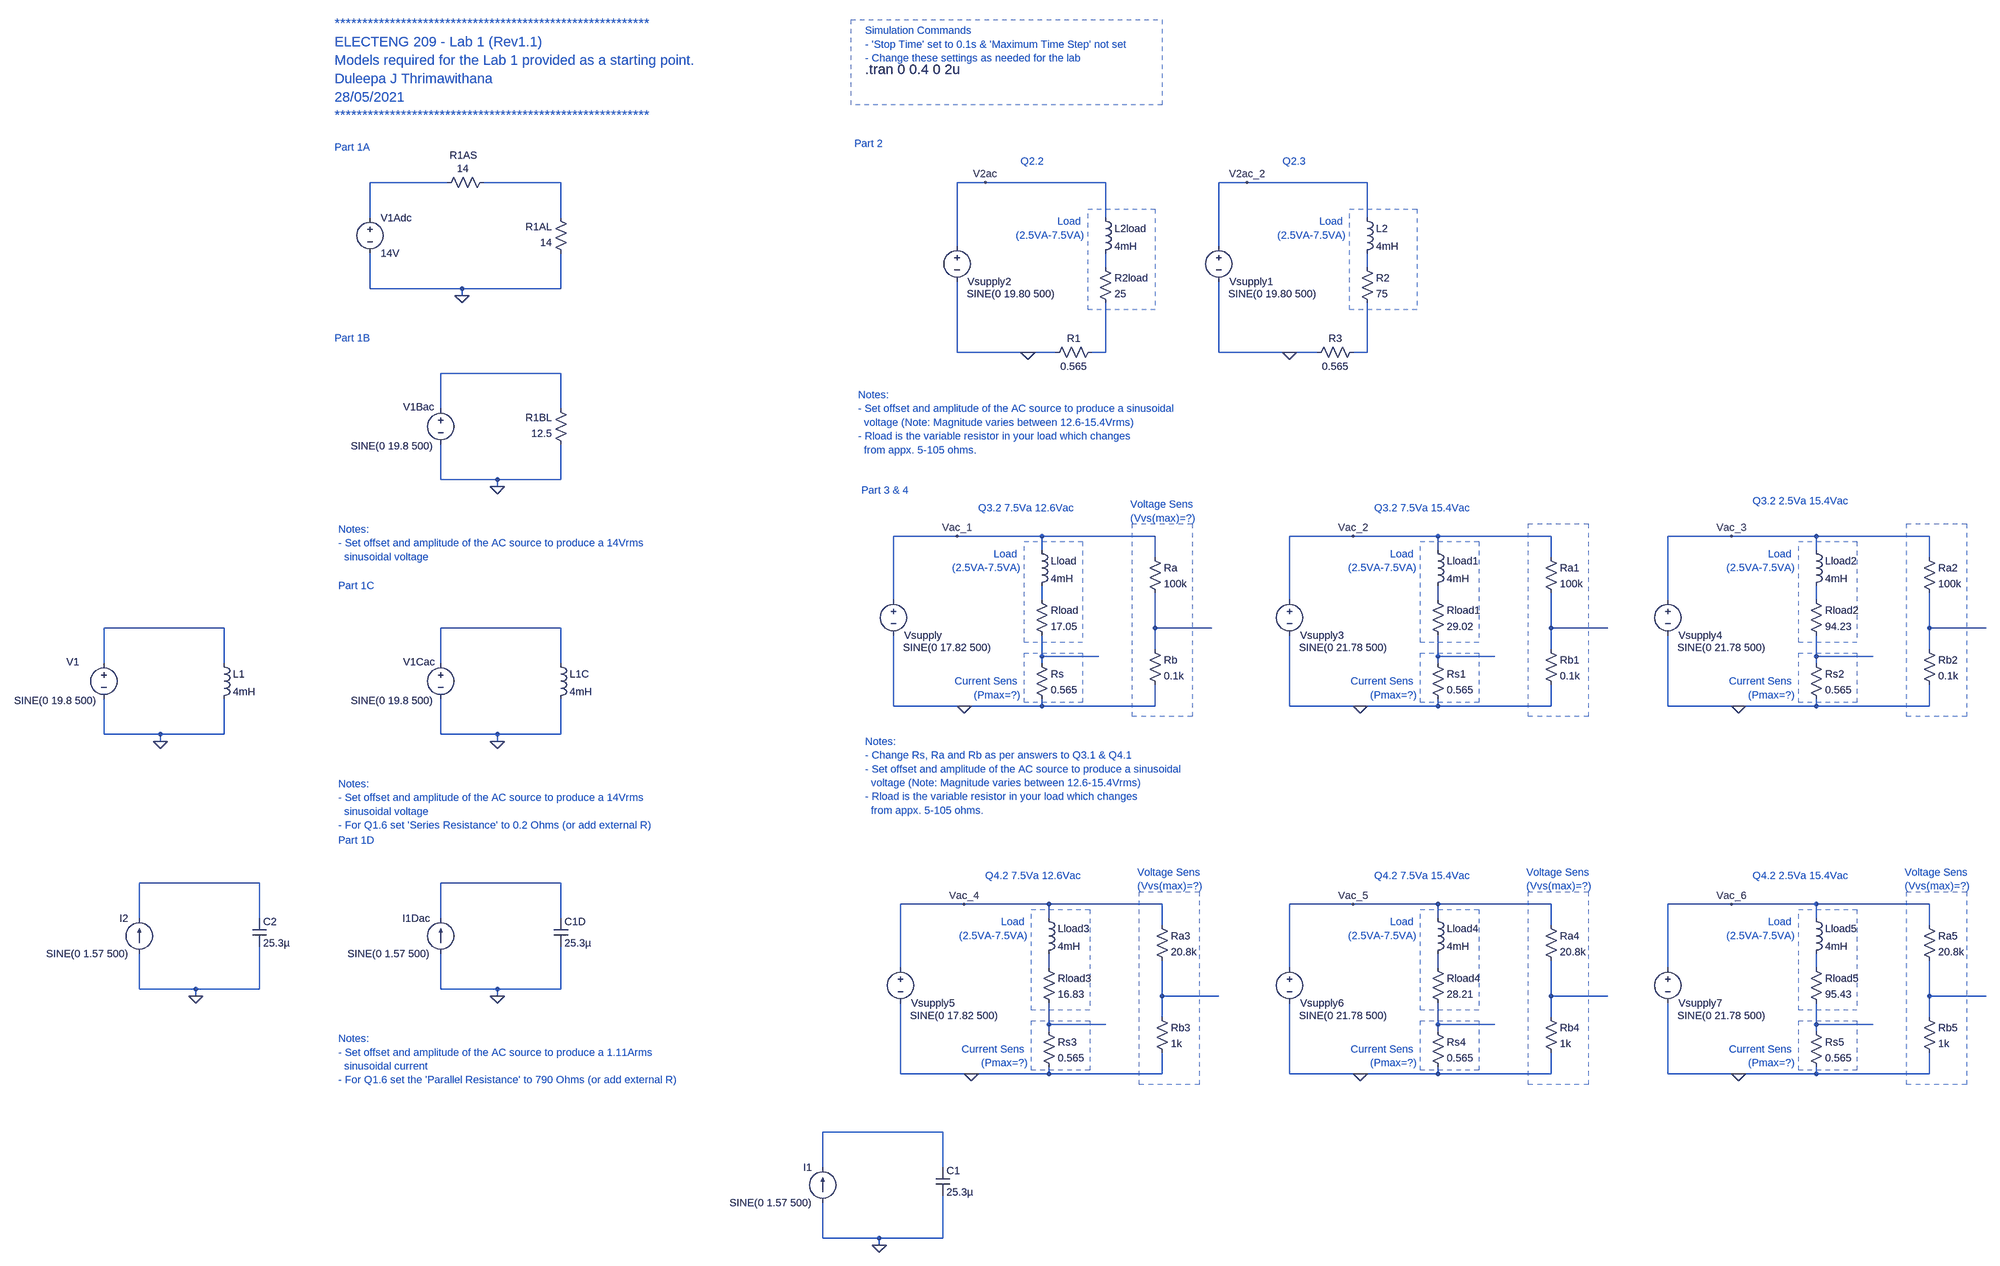
[diagram p0: schematic Lab1_Sensors_Q4.asc]
Lab1_Sensors_Q4.asc, the LTspice schematic file:
Version 4.1
SHEET 1 2980 2980
WIRE -528 144 -704 144
WIRE -272 144 -448 144
WIRE 688 144 624 144
WIRE 960 144 688 144
WIRE 1280 144 1216 144
WIRE 1552 144 1280 144
WIRE -704 224 -704 144
WIRE -272 224 -272 144
WIRE 960 224 960 144
WIRE 1552 224 1552 144
WIRE 624 288 624 144
WIRE 1216 288 1216 144
WIRE 960 336 960 304
WIRE 1552 336 1552 304
WIRE -704 384 -704 304
WIRE -496 384 -704 384
WIRE -272 384 -272 304
WIRE -272 384 -496 384
WIRE -496 400 -496 384
WIRE 624 528 624 368
WIRE 784 528 624 528
WIRE 848 528 784 528
WIRE 960 528 960 416
WIRE 960 528 928 528
WIRE 1216 528 1216 368
WIRE 1376 528 1216 528
WIRE 1440 528 1376 528
WIRE 1552 528 1552 416
WIRE 1552 528 1520 528
WIRE -272 576 -544 576
WIRE -544 656 -544 576
WIRE -272 656 -272 576
WIRE -544 816 -544 736
WIRE -416 816 -544 816
WIRE -272 816 -272 736
WIRE -272 816 -416 816
WIRE -416 832 -416 816
WIRE 624 944 480 944
WIRE 816 944 624 944
WIRE 1072 944 816 944
WIRE 1520 944 1376 944
WIRE 1712 944 1520 944
WIRE 1968 944 1712 944
WIRE 2384 944 2240 944
WIRE 2576 944 2384 944
WIRE 2832 944 2576 944
WIRE 816 976 816 944
WIRE 1712 976 1712 944
WIRE 2576 976 2576 944
WIRE 1072 992 1072 944
WIRE 1968 992 1968 944
WIRE 2832 992 2832 944
WIRE 480 1088 480 944
WIRE 816 1088 816 1056
WIRE 1376 1088 1376 944
WIRE 1712 1088 1712 1056
WIRE 2240 1088 2240 944
WIRE 2576 1088 2576 1056
WIRE -1184 1152 -1456 1152
WIRE -272 1152 -544 1152
WIRE 1072 1152 1072 1072
WIRE 1200 1152 1072 1152
WIRE 1968 1152 1968 1072
WIRE 2096 1152 1968 1152
WIRE 2832 1152 2832 1072
WIRE 2960 1152 2832 1152
WIRE 1072 1200 1072 1152
WIRE 1968 1200 1968 1152
WIRE 2832 1200 2832 1152
WIRE 816 1216 816 1168
WIRE 944 1216 816 1216
WIRE 1712 1216 1712 1168
WIRE 1840 1216 1712 1216
WIRE 2576 1216 2576 1168
WIRE 2704 1216 2576 1216
WIRE -1456 1232 -1456 1152
WIRE -1184 1232 -1184 1152
WIRE -544 1232 -544 1152
WIRE -272 1232 -272 1152
WIRE 816 1232 816 1216
WIRE 1712 1232 1712 1216
WIRE 2576 1232 2576 1216
WIRE 480 1328 480 1168
WIRE 640 1328 480 1328
WIRE 816 1328 816 1312
WIRE 816 1328 640 1328
WIRE 1072 1328 1072 1280
WIRE 1072 1328 816 1328
WIRE 1376 1328 1376 1168
WIRE 1536 1328 1376 1328
WIRE 1712 1328 1712 1312
WIRE 1712 1328 1536 1328
WIRE 1968 1328 1968 1280
WIRE 1968 1328 1712 1328
WIRE 2240 1328 2240 1168
WIRE 2400 1328 2240 1328
WIRE 2576 1328 2576 1312
WIRE 2576 1328 2400 1328
WIRE 2832 1328 2832 1280
WIRE 2832 1328 2576 1328
WIRE -1456 1392 -1456 1312
WIRE -1328 1392 -1456 1392
WIRE -1184 1392 -1184 1312
WIRE -1184 1392 -1328 1392
WIRE -544 1392 -544 1312
WIRE -416 1392 -544 1392
WIRE -272 1392 -272 1312
WIRE -272 1392 -416 1392
WIRE -1328 1408 -1328 1392
WIRE -416 1408 -416 1392
WIRE -1104 1728 -1376 1728
WIRE -272 1728 -544 1728
WIRE 640 1776 496 1776
WIRE 832 1776 640 1776
WIRE 1088 1776 832 1776
WIRE 1520 1776 1376 1776
WIRE 1712 1776 1520 1776
WIRE 1968 1776 1712 1776
WIRE 2384 1776 2240 1776
WIRE 2576 1776 2384 1776
WIRE 2832 1776 2576 1776
WIRE -1376 1808 -1376 1728
WIRE -1104 1808 -1104 1728
WIRE -544 1808 -544 1728
WIRE -272 1808 -272 1728
WIRE 832 1808 832 1776
WIRE 1712 1808 1712 1776
WIRE 2576 1808 2576 1776
WIRE 1088 1824 1088 1776
WIRE 1968 1824 1968 1776
WIRE 2832 1824 2832 1776
WIRE 496 1920 496 1776
WIRE 832 1920 832 1888
WIRE 1376 1920 1376 1776
WIRE 1712 1920 1712 1888
WIRE 2240 1920 2240 1776
WIRE 2576 1920 2576 1888
WIRE -1376 1968 -1376 1888
WIRE -1248 1968 -1376 1968
WIRE -1104 1968 -1104 1872
WIRE -1104 1968 -1248 1968
WIRE -544 1968 -544 1888
WIRE -416 1968 -544 1968
WIRE -272 1968 -272 1872
WIRE -272 1968 -416 1968
WIRE -1248 1984 -1248 1968
WIRE -416 1984 -416 1968
WIRE 1088 1984 1088 1904
WIRE 1216 1984 1088 1984
WIRE 1968 1984 1968 1904
WIRE 2096 1984 1968 1984
WIRE 2832 1984 2832 1904
WIRE 2960 1984 2832 1984
WIRE 1088 2032 1088 1984
WIRE 1968 2032 1968 1984
WIRE 2832 2032 2832 1984
WIRE 832 2048 832 2000
WIRE 960 2048 832 2048
WIRE 1712 2048 1712 2000
WIRE 1840 2048 1712 2048
WIRE 2576 2048 2576 2000
WIRE 2704 2048 2576 2048
WIRE 832 2064 832 2048
WIRE 1712 2064 1712 2048
WIRE 2576 2064 2576 2048
WIRE 496 2160 496 2000
WIRE 656 2160 496 2160
WIRE 832 2160 832 2144
WIRE 832 2160 656 2160
WIRE 1088 2160 1088 2112
WIRE 1088 2160 832 2160
WIRE 1376 2160 1376 2000
WIRE 1536 2160 1376 2160
WIRE 1712 2160 1712 2144
WIRE 1712 2160 1536 2160
WIRE 1968 2160 1968 2112
WIRE 1968 2160 1712 2160
WIRE 2240 2160 2240 2000
WIRE 2400 2160 2240 2160
WIRE 2576 2160 2576 2144
WIRE 2576 2160 2400 2160
WIRE 2832 2160 2832 2112
WIRE 2832 2160 2576 2160
WIRE 592 2448 320 2448
WIRE 320 2528 320 2448
WIRE 592 2528 592 2448
WIRE 320 2688 320 2608
WIRE 448 2688 320 2688
WIRE 592 2688 592 2592
WIRE 592 2688 448 2688
WIRE 448 2704 448 2688
FLAG 784 528 0
FLAG 688 144 V2ac
FLAG -496 400 0
FLAG -416 832 0
FLAG -416 1408 0
FLAG -416 1984 0
FLAG 640 1328 0
FLAG 624 944 Vac_1
FLAG 448 2704 0
FLAG -1328 1408 0
FLAG -1248 1984 0
FLAG 1376 528 0
FLAG 1280 144 V2ac_2
FLAG 1536 1328 0
FLAG 1520 944 Vac_2
FLAG 2400 1328 0
FLAG 2384 944 Vac_3
FLAG 656 2160 0
FLAG 640 1776 Vac_4
FLAG 1536 2160 0
FLAG 1520 1776 Vac_5
FLAG 2400 2160 0
FLAG 2384 1776 Vac_6
SYMBOL voltage 624 272 R0
WINDOW 0 24 96 Left 2
WINDOW 3 22 124 Left 2
WINDOW 123 0 0 Left 0
WINDOW 39 0 0 Left 0
SYMATTR InstName Vsupply2
SYMATTR Value SINE(0 19.80 500)
SYMBOL res 944 320 R0
SYMATTR InstName R2load
SYMATTR Value 25
SYMBOL ind 944 208 R0
SYMATTR InstName L2load
SYMATTR Value 4mH
SYMATTR SpiceLine Rser=0
SYMBOL voltage -704 208 R0
SYMATTR InstName V1Adc
SYMATTR Value 14V
SYMBOL res -432 128 R90
WINDOW 0 -30 61 VBottom 2
WINDOW 3 -31 62 VTop 2
SYMATTR InstName R1AS
SYMATTR Value 14
SYMBOL res -256 320 R180
WINDOW 0 36 76 Left 2
WINDOW 3 36 40 Left 2
SYMATTR InstName R1AL
SYMATTR Value 14
SYMBOL voltage -544 640 R0
WINDOW 0 -85 12 Left 2
WINDOW 3 -203 100 Left 2
WINDOW 123 0 0 Left 0
WINDOW 39 0 0 Left 0
SYMATTR InstName V1Bac
SYMATTR Value SINE(0 19.8 500)
SYMBOL res -256 752 R180
WINDOW 0 36 76 Left 2
WINDOW 3 36 40 Left 2
SYMATTR InstName R1BL
SYMATTR Value 12.5
SYMBOL voltage -544 1216 R0
WINDOW 0 -85 12 Left 2
WINDOW 3 -203 100 Left 2
WINDOW 123 0 0 Left 0
WINDOW 39 0 0 Left 0
SYMATTR InstName V1Cac
SYMATTR Value SINE(0 19.8 500)
SYMBOL ind -288 1216 R0
SYMATTR InstName L1C
SYMATTR Value 4mH
SYMATTR SpiceLine Rser=0.2
SYMBOL cap -288 1808 R0
SYMATTR InstName C1D
SYMATTR Value 25.3µ
SYMATTR SpiceLine Rpar=790
SYMBOL current -544 1888 R180
WINDOW 0 24 80 Left 2
WINDOW 3 24 0 Left 2
WINDOW 123 0 0 Left 0
WINDOW 39 0 0 Left 0
SYMATTR InstName I1Dac
SYMATTR Value SINE(0 1.57 500)
SYMBOL voltage 480 1072 R0
WINDOW 0 24 96 Left 2
WINDOW 3 22 124 Left 2
WINDOW 123 0 0 Left 0
WINDOW 39 0 0 Left 0
SYMATTR InstName Vsupply
SYMATTR Value SINE(0 17.82 500)
SYMBOL res 800 1072 R0
SYMATTR InstName Rload
SYMATTR Value 17.05
SYMBOL ind 800 960 R0
SYMATTR InstName Lload
SYMATTR Value 4mH
SYMATTR SpiceLine Rser=0
SYMBOL res 800 1216 R0
SYMATTR InstName Rs
SYMATTR Value 0.565
SYMBOL res 1056 976 R0
SYMATTR InstName Ra
SYMATTR Value 100k
SYMBOL res 1056 1184 R0
SYMATTR InstName Rb
SYMATTR Value 0.1k
SYMBOL cap 576 2528 R0
SYMATTR InstName C1
SYMATTR Value 25.3µ
SYMBOL current 320 2608 R180
WINDOW 0 24 80 Left 2
WINDOW 3 24 0 Left 2
WINDOW 123 0 0 Left 0
WINDOW 39 0 0 Left 0
SYMATTR InstName I1
SYMATTR Value SINE(0 1.57 500)
SYMBOL voltage -1456 1216 R0
WINDOW 0 -85 12 Left 2
WINDOW 3 -203 100 Left 2
WINDOW 123 0 0 Left 0
WINDOW 39 0 0 Left 0
SYMATTR InstName V1
SYMATTR Value SINE(0 19.8 500)
SYMBOL ind -1200 1216 R0
SYMATTR InstName L1
SYMATTR Value 4mH
SYMATTR SpiceLine Rser=0.2
SYMBOL cap -1120 1808 R0
SYMATTR InstName C2
SYMATTR Value 25.3µ
SYMATTR SpiceLine Rpar=790
SYMBOL current -1376 1888 R180
WINDOW 0 24 80 Left 2
WINDOW 3 24 0 Left 2
WINDOW 123 0 0 Left 0
WINDOW 39 0 0 Left 0
SYMATTR InstName I2
SYMATTR Value SINE(0 1.57 500)
SYMBOL res 944 512 R90
WINDOW 0 0 56 VBottom 2
WINDOW 3 32 56 VTop 2
SYMATTR InstName R1
SYMATTR Value 0.565
SYMBOL voltage 1216 272 R0
WINDOW 0 24 96 Left 2
WINDOW 3 22 124 Left 2
WINDOW 123 0 0 Left 0
WINDOW 39 0 0 Left 0
SYMATTR InstName Vsupply1
SYMATTR Value SINE(0 19.80 500)
SYMBOL res 1536 320 R0
SYMATTR InstName R2
SYMATTR Value 75
SYMBOL ind 1536 208 R0
SYMATTR InstName L2
SYMATTR Value 4mH
SYMATTR SpiceLine Rser=0
SYMBOL res 1536 512 R90
WINDOW 0 0 56 VBottom 2
WINDOW 3 32 56 VTop 2
SYMATTR InstName R3
SYMATTR Value 0.565
SYMBOL voltage 1376 1072 R0
WINDOW 0 24 96 Left 2
WINDOW 3 22 124 Left 2
WINDOW 123 0 0 Left 0
WINDOW 39 0 0 Left 0
SYMATTR InstName Vsupply3
SYMATTR Value SINE(0 21.78 500)
SYMBOL res 1696 1072 R0
SYMATTR InstName Rload1
SYMATTR Value 29.02
SYMBOL ind 1696 960 R0
SYMATTR InstName Lload1
SYMATTR Value 4mH
SYMATTR SpiceLine Rser=0
SYMBOL res 1696 1216 R0
SYMATTR InstName Rs1
SYMATTR Value 0.565
SYMBOL res 1952 976 R0
SYMATTR InstName Ra1
SYMATTR Value 100k
SYMBOL res 1952 1184 R0
SYMATTR InstName Rb1
SYMATTR Value 0.1k
SYMBOL voltage 2240 1072 R0
WINDOW 0 24 96 Left 2
WINDOW 3 22 124 Left 2
WINDOW 123 0 0 Left 0
WINDOW 39 0 0 Left 0
SYMATTR InstName Vsupply4
SYMATTR Value SINE(0 21.78 500)
SYMBOL res 2560 1072 R0
SYMATTR InstName Rload2
SYMATTR Value 94.23
SYMBOL ind 2560 960 R0
SYMATTR InstName Lload2
SYMATTR Value 4mH
SYMATTR SpiceLine Rser=0
SYMBOL res 2560 1216 R0
SYMATTR InstName Rs2
SYMATTR Value 0.565
SYMBOL res 2816 976 R0
SYMATTR InstName Ra2
SYMATTR Value 100k
SYMBOL res 2816 1184 R0
SYMATTR InstName Rb2
SYMATTR Value 0.1k
SYMBOL voltage 496 1904 R0
WINDOW 0 24 96 Left 2
WINDOW 3 22 124 Left 2
WINDOW 123 0 0 Left 0
WINDOW 39 0 0 Left 0
SYMATTR InstName Vsupply5
SYMATTR Value SINE(0 17.82 500)
SYMBOL res 816 1904 R0
SYMATTR InstName Rload3
SYMATTR Value 16.83
SYMBOL ind 816 1792 R0
SYMATTR InstName Lload3
SYMATTR Value 4mH
SYMATTR SpiceLine Rser=0
SYMBOL res 816 2048 R0
SYMATTR InstName Rs3
SYMATTR Value 0.565
SYMBOL res 1072 1808 R0
SYMATTR InstName Ra3
SYMATTR Value 20.8k
SYMBOL res 1072 2016 R0
SYMATTR InstName Rb3
SYMATTR Value 1k
SYMBOL voltage 1376 1904 R0
WINDOW 0 24 96 Left 2
WINDOW 3 22 124 Left 2
WINDOW 123 0 0 Left 0
WINDOW 39 0 0 Left 0
SYMATTR InstName Vsupply6
SYMATTR Value SINE(0 21.78 500)
SYMBOL res 1696 1904 R0
SYMATTR InstName Rload4
SYMATTR Value 28.21
SYMBOL ind 1696 1792 R0
SYMATTR InstName Lload4
SYMATTR Value 4mH
SYMATTR SpiceLine Rser=0
SYMBOL res 1696 2048 R0
SYMATTR InstName Rs4
SYMATTR Value 0.565
SYMBOL res 1952 1808 R0
SYMATTR InstName Ra4
SYMATTR Value 20.8k
SYMBOL res 1952 2016 R0
SYMATTR InstName Rb4
SYMATTR Value 1k
SYMBOL voltage 2240 1904 R0
WINDOW 0 24 96 Left 2
WINDOW 3 22 124 Left 2
WINDOW 123 0 0 Left 0
WINDOW 39 0 0 Left 0
SYMATTR InstName Vsupply7
SYMATTR Value SINE(0 21.78 500)
SYMBOL res 2560 1904 R0
SYMATTR InstName Rload5
SYMATTR Value 95.43
SYMBOL ind 2560 1792 R0
SYMATTR InstName Lload5
SYMATTR Value 4mH
SYMATTR SpiceLine Rser=0
SYMBOL res 2560 2048 R0
SYMATTR InstName Rs5
SYMATTR Value 0.565
SYMBOL res 2816 1808 R0
SYMATTR InstName Ra5
SYMATTR Value 20.8k
SYMBOL res 2816 2016 R0
SYMATTR InstName Rb5
SYMATTR Value 1k
TEXT -784 64 Left 2 ;Part 1A
TEXT -784 496 Left 2 ;Part 1B
TEXT -784 -216 Left 3 ;*********************************************************\nELECTENG 209 - Lab 1 (Rev1.1)\nModels required for the Lab 1 provided as a starting point.\nDuleepa J Thrimawithana\n28/05/2021\n*********************************************************
TEXT 392 56 Left 2 ;Part 2
TEXT 400 624 Left 2 ;Notes: \n- Set offset and amplitude of the AC source to produce a sinusoidal\n  voltage (Note: Magnitude varies between 12.6-15.4Vrms)\n- Rload is the variable resistor in your load which changes \n  from appx. 5-105 ohms.
TEXT 912 232 Right 2 ;Load \n(2.5VA-7.5VA)
TEXT 416 -200 Left 2 ;Simulation Commands\n- 'Stop Time' set to 0.1s & 'Maximum Time Step' not set\n- Change these settings as needed for the lab
TEXT -776 1056 Left 2 ;Part 1C
TEXT -776 928 Left 2 ;Notes: \n- Set offset and amplitude of the AC source to produce a 14Vrms \n  sinusoidal voltage
TEXT 416 -112 Left 3 !.tran 0 0.4 0 2u
TEXT -776 1504 Left 2 ;Notes: \n- Set offset and amplitude of the AC source to produce a 14Vrms \n  sinusoidal voltage\n- For Q1.6 set 'Series Resistance' to 0.2 Ohms (or add external R)
TEXT -776 1632 Left 2 ;Part 1D
TEXT -776 2080 Left 2 ;Notes: \n- Set offset and amplitude of the AC source to produce a 1.11Arms \n  sinusoidal current\n- For Q1.6 set the 'Parallel Resistance' to 790 Ohms (or add external R)
TEXT 408 840 Left 2 ;Part 3 & 4
TEXT 416 1408 Left 2 ;Notes: \n- Change Rs, Ra and Rb as per answers to Q3.1 & Q4.1\n- Set offset and amplitude of the AC source to produce a sinusoidal\n  voltage (Note: Magnitude varies between 12.6-15.4Vrms)\n- Rload is the variable resistor in your load which changes \n  from appx. 5-105 ohms.
TEXT 768 984 Right 2 ;Load \n(2.5VA-7.5VA)
TEXT 768 1272 Right 2 ;Current Sens \n(Pmax=?)
TEXT 1016 872 Left 2 ;Voltage Sens\n(Vvs(max)=?)
TEXT 768 96 Left 2 ;Q2.2
TEXT 1504 232 Right 2 ;Load \n(2.5VA-7.5VA)
TEXT 1360 96 Left 2 ;Q2.3
TEXT 1664 984 Right 2 ;Load \n(2.5VA-7.5VA)
TEXT 1664 1272 Right 2 ;Current Sens \n(Pmax=?)
TEXT 2528 984 Right 2 ;Load \n(2.5VA-7.5VA)
TEXT 2528 1272 Right 2 ;Current Sens \n(Pmax=?)
TEXT 672 880 Left 2 ;Q3.2 7.5Va 12.6Vac
TEXT 1568 880 Left 2 ;Q3.2 7.5Va 15.4Vac
TEXT 2432 864 Left 2 ;Q3.2 2.5Va 15.4Vac
TEXT 784 1816 Right 2 ;Load \n(2.5VA-7.5VA)
TEXT 784 2104 Right 2 ;Current Sens \n(Pmax=?)
TEXT 1032 1704 Left 2 ;Voltage Sens\n(Vvs(max)=?)
TEXT 688 1712 Left 2 ;Q4.2 7.5Va 12.6Vac
TEXT 1664 1816 Right 2 ;Load \n(2.5VA-7.5VA)
TEXT 1664 2104 Right 2 ;Current Sens \n(Pmax=?)
TEXT 1912 1704 Left 2 ;Voltage Sens\n(Vvs(max)=?)
TEXT 1568 1712 Left 2 ;Q4.2 7.5Va 15.4Vac
TEXT 2528 1816 Right 2 ;Load \n(2.5VA-7.5VA)
TEXT 2528 2104 Right 2 ;Current Sens \n(Pmax=?)
TEXT 2776 1704 Left 2 ;Voltage Sens\n(Vvs(max)=?)
TEXT 2432 1712 Left 2 ;Q4.2 2.5Va 15.4Vac
RECTANGLE Normal 1020 916 1156 1352 2
RECTANGLE Normal 920 204 1072 432 2
RECTANGLE Normal 776 956 908 1184 2
RECTANGLE Normal 776 1208 908 1320 2
RECTANGLE Normal 1088 -32 384 -224 2
RECTANGLE Normal 1512 204 1664 432 2
RECTANGLE Normal 1916 916 2052 1352 2
RECTANGLE Normal 1672 956 1804 1184 2
RECTANGLE Normal 1672 1208 1804 1320 2
RECTANGLE Normal 2780 916 2916 1352 2
RECTANGLE Normal 2536 956 2668 1184 2
RECTANGLE Normal 2536 1208 2668 1320 2
RECTANGLE Normal 1036 1748 1172 2184 2
RECTANGLE Normal 792 1788 924 2016 2
RECTANGLE Normal 792 2040 924 2152 2
RECTANGLE Normal 1916 1748 2052 2184 2
RECTANGLE Normal 1672 1788 1804 2016 2
RECTANGLE Normal 1672 2040 1804 2152 2
RECTANGLE Normal 2780 1748 2916 2184 2
RECTANGLE Normal 2536 1788 2668 2016 2
RECTANGLE Normal 2536 2040 2668 2152 2

The netlist it stands for:
* Lab1_Sensors_Q4.asc
Vsupply2 V2ac 0 SINE(0 19.80 500)
R2load N003 N005 25
L2load V2ac N003 4mH Rser=0
V1Adc N001 0 14V
R1AS N002 N001 14
R1AL 0 N002 14
V1Bac N007 0 SINE(0 19.8 500)
R1BL 0 N007 12.5
V1Cac N012 0 SINE(0 19.8 500)
L1C N012 0 4mH Rser=0.2
C1D N020 0 25.3µ Rpar=790
I1Dac 0 N020 SINE(0 1.57 500)
Vsupply Vac_1 0 SINE(0 17.82 500)
Rload N008 N016 17.05
Lload Vac_1 N008 4mH Rser=0
Rs N016 0 0.565
Ra Vac_1 N013 100k
Rb N013 0 0.1k
C1 N030 0 25.3µ
I1 0 N030 SINE(0 1.57 500)
V1 N011 0 SINE(0 19.8 500)
L1 N011 0 4mH Rser=0.2
C2 N019 0 25.3µ Rpar=790
I2 0 N019 SINE(0 1.57 500)
R1 N005 0 0.565
Vsupply1 V2ac_2 0 SINE(0 19.80 500)
R2 N004 N006 75
L2 V2ac_2 N004 4mH Rser=0
R3 N006 0 0.565
Vsupply3 Vac_2 0 SINE(0 21.78 500)
Rload1 N009 N017 29.02
Lload1 Vac_2 N009 4mH Rser=0
Rs1 N017 0 0.565
Ra1 Vac_2 N014 100k
Rb1 N014 0 0.1k
Vsupply4 Vac_3 0 SINE(0 21.78 500)
Rload2 N010 N018 94.23
Lload2 Vac_3 N010 4mH Rser=0
Rs2 N018 0 0.565
Ra2 Vac_3 N015 100k
Rb2 N015 0 0.1k
Vsupply5 Vac_4 0 SINE(0 17.82 500)
Rload3 N021 N027 16.83
Lload3 Vac_4 N021 4mH Rser=0
Rs3 N027 0 0.565
Ra3 Vac_4 N024 20.8k
Rb3 N024 0 1k
Vsupply6 Vac_5 0 SINE(0 21.78 500)
Rload4 N022 N028 28.21
Lload4 Vac_5 N022 4mH Rser=0
Rs4 N028 0 0.565
Ra4 Vac_5 N025 20.8k
Rb4 N025 0 1k
Vsupply7 Vac_6 0 SINE(0 21.78 500)
Rload5 N023 N029 95.43
Lload5 Vac_6 N023 4mH Rser=0
Rs5 N029 0 0.565
Ra5 Vac_6 N026 20.8k
Rb5 N026 0 1k
* Part 1A
* Part 1B
* *********************************************************
* ELECTENG 209 - Lab 1 (Rev1.1)
* Models required for the Lab 1 provided as a starting point.
* Duleepa J Thrimawithana
* 28/05/2021
* *********************************************************
* Part 2
* Notes:
* - Set offset and amplitude of the AC source to produce a sinusoidal
*   voltage (Note: Magnitude varies between 12.6-15.4Vrms)
* - Rload is the variable resistor in your load which changes
*   from appx. 5-105 ohms.
* Load
* (2.5VA-7.5VA)
* Simulation Commands
* - 'Stop Time' set to 0.1s & 'Maximum Time Step' not set
* - Change these settings as needed for the lab
* Part 1C
* Notes:
* - Set offset and amplitude of the AC source to produce a 14Vrms
*   sinusoidal voltage
.tran 0 0.4 0 2u
* Notes:
* - Set offset and amplitude of the AC source to produce a 14Vrms
*   sinusoidal voltage
* - For Q1.6 set 'Series Resistance' to 0.2 Ohms (or add external R)
* Part 1D
* Notes:
* - Set offset and amplitude of the AC source to produce a 1.11Arms
*   sinusoidal current
* - For Q1.6 set the 'Parallel Resistance' to 790 Ohms (or add external R)
* Part 3 & 4
* Notes:
* - Change Rs, Ra and Rb as per answers to Q3.1 & Q4.1
* - Set offset and amplitude of the AC source to produce a sinusoidal
*   voltage (Note: Magnitude varies between 12.6-15.4Vrms)
* - Rload is the variable resistor in your load which changes
*   from appx. 5-105 ohms.
* Load
* (2.5VA-7.5VA)
* Current Sens
* (Pmax=?)
* Voltage Sens
* (Vvs(max)=?)
* Q2.2
* Load
* (2.5VA-7.5VA)
* Q2.3
* Load
* (2.5VA-7.5VA)
* Current Sens
* (Pmax=?)
* Load
* (2.5VA-7.5VA)
* Current Sens
* (Pmax=?)
* Q3.2 7.5Va 12.6Vac
* Q3.2 7.5Va 15.4Vac
* Q3.2 2.5Va 15.4Vac
* Load
* (2.5VA-7.5VA)
* Current Sens
* (Pmax=?)
* Voltage Sens
* (Vvs(max)=?)
* Q4.2 7.5Va 12.6Vac
* Load
* (2.5VA-7.5VA)
* Current Sens
* (Pmax=?)
* Voltage Sens
* (Vvs(max)=?)
* Q4.2 7.5Va 15.4Vac
* Load
* (2.5VA-7.5VA)
* Current Sens
* (Pmax=?)
* Voltage Sens
* (Vvs(max)=?)
* Q4.2 2.5Va 15.4Vac
.backanno
.end